# Altium schematic sheet MGD.SCH1.SchDoc
size C
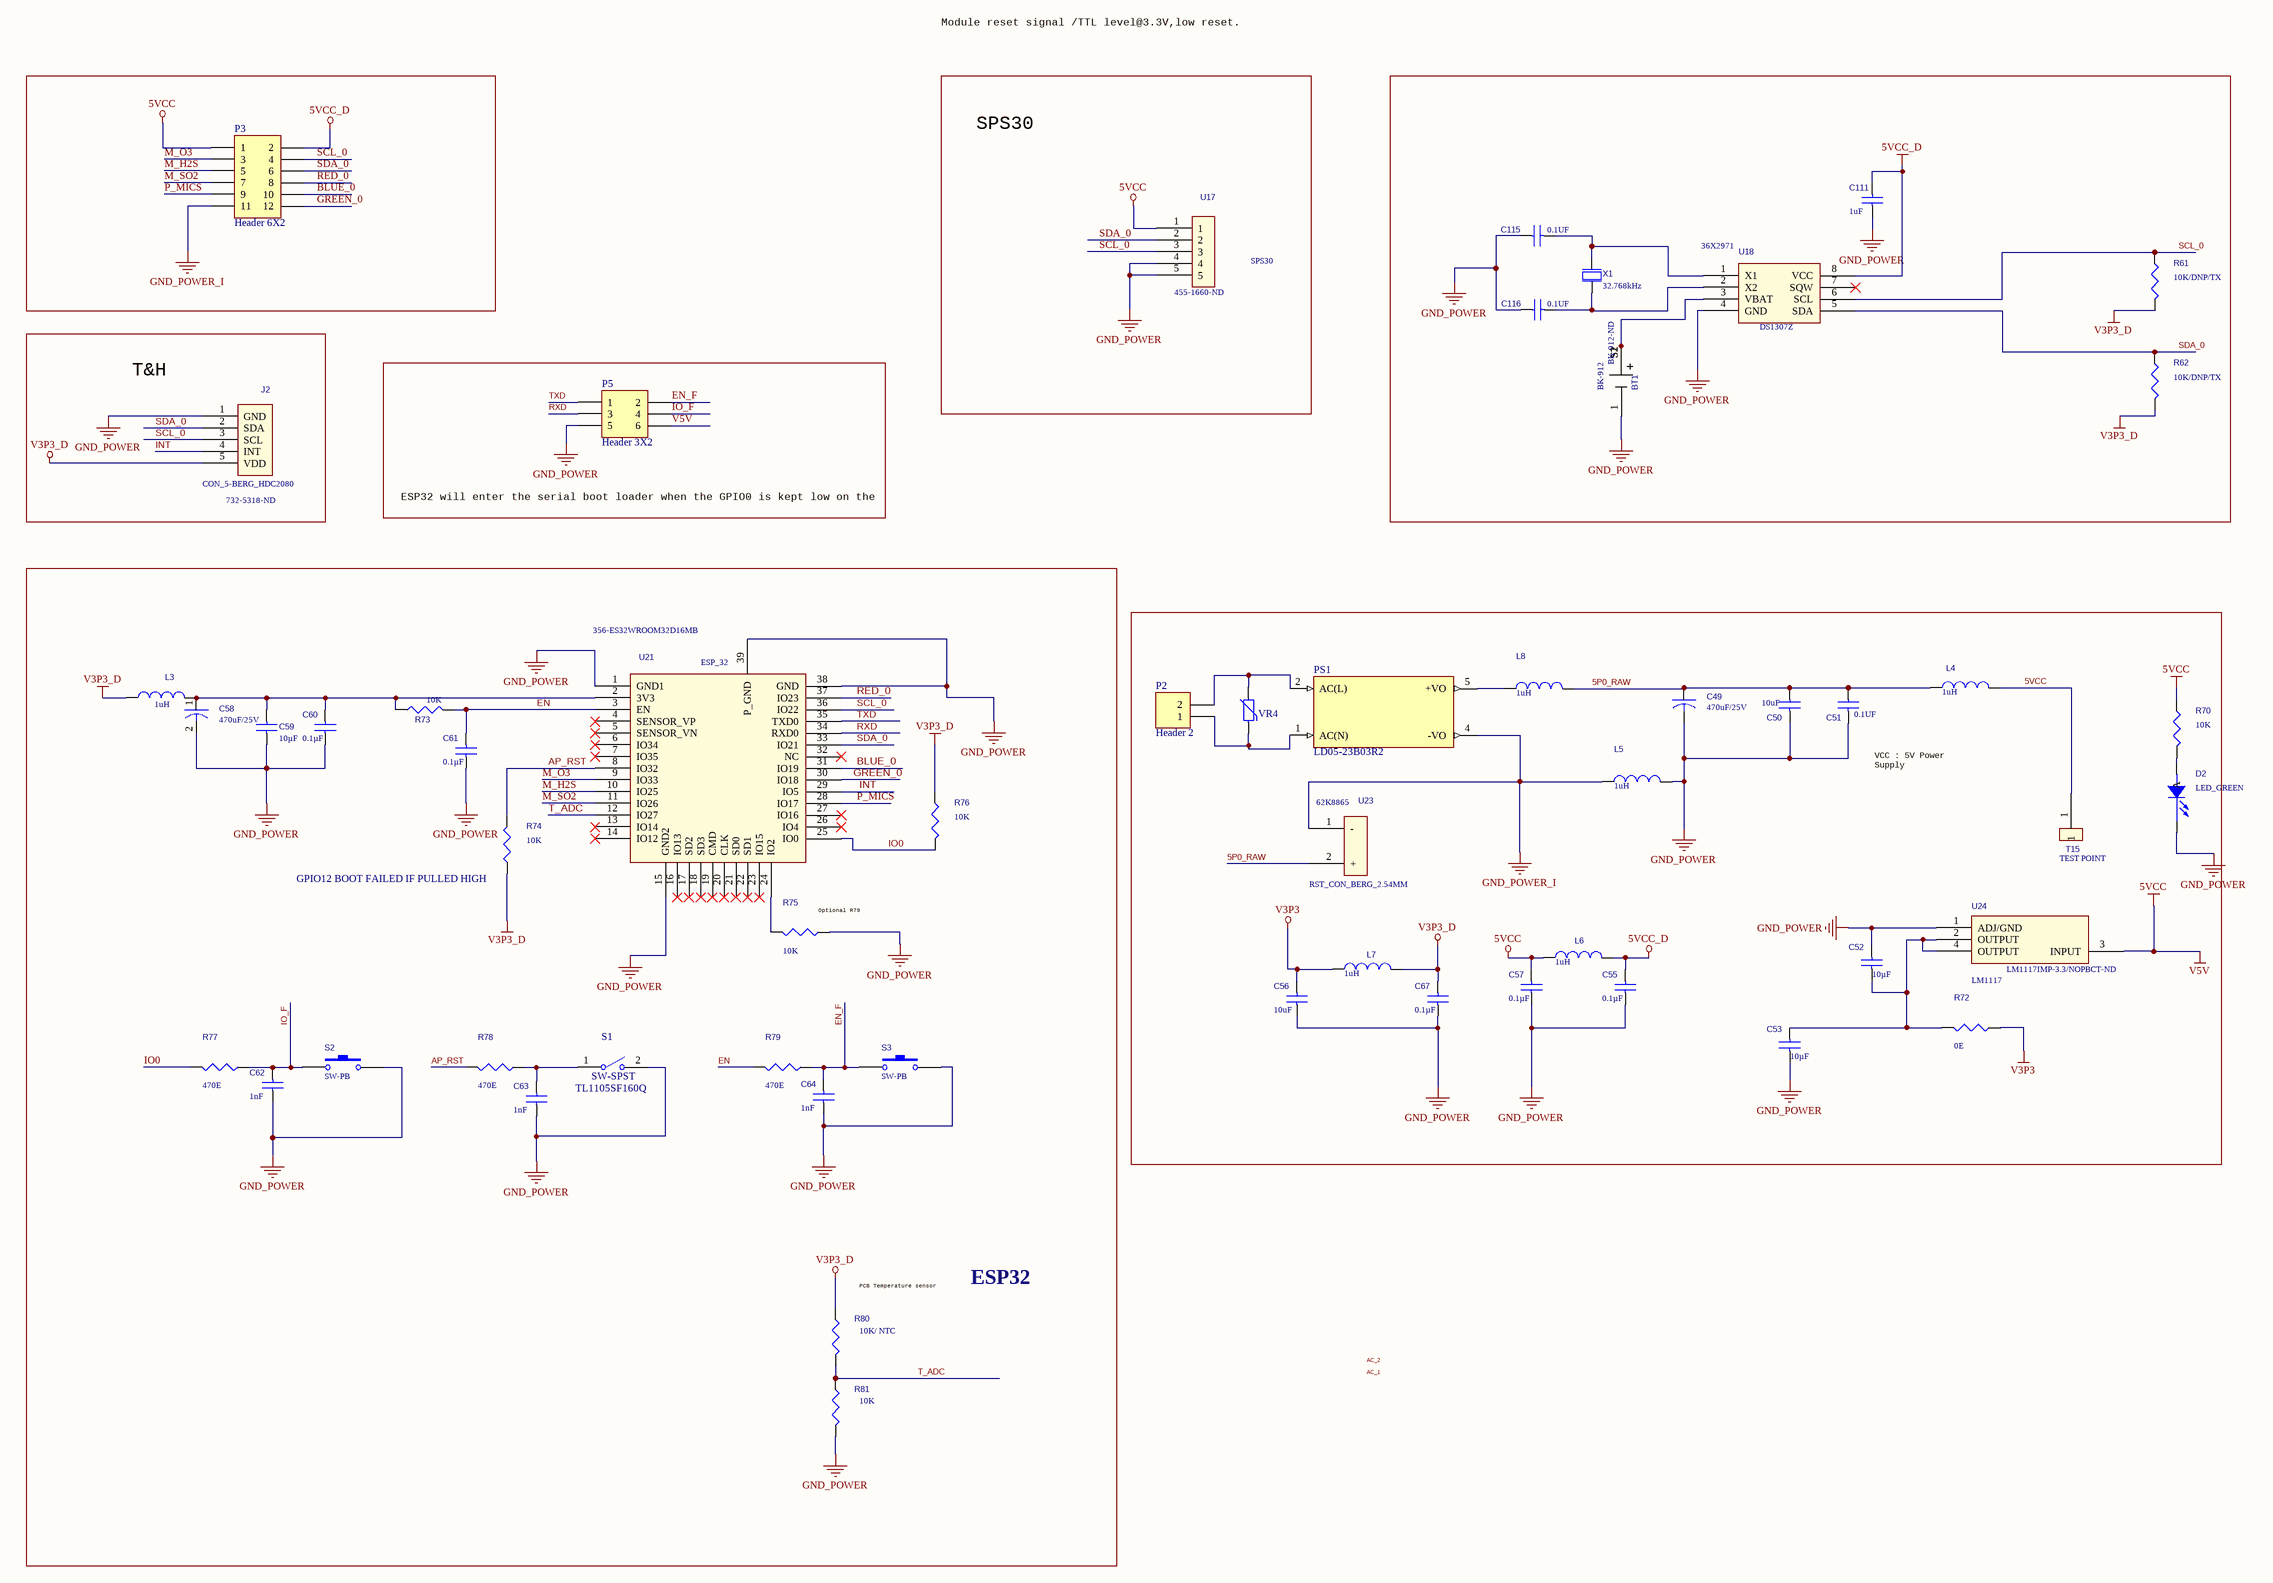
[diagram p0: MGD.SCH1.SchDoc]

## Parts
BT1  BK-912  Supplier Part Number 1: BK-912-ND  [BT1]
C49  470uF/25V  [C16, C49, C58]
C50  10uF  [C0603]
C51  0.1UF  [C0603]
C52  10µF  [C0603]
C53  10µF  [C0603]
C55  0.1µF  [C0603]
C56  10uF  [C0603]
C57  0.1µF  [C0603]
C58  470uF/25V  [C16, C49, C58]
C59  10µF  [C0603]
C60  0.1µF  [C0603]
C61  0.1µF  [C0603]
C62  1nF  [C0603]
C63  1nF  [C0603]
C64  1nF  [C0603]
C67  0.1µF  [C0603]
C111  1uF  [C0603]
C115  0.1UF  [C0603]
C116  0.1UF  [C0603]
D2  LED_GREEN  [D2              L0603]
J2  CON_5-BERG_HDC2080  Supplier Part Number 1: 732-5318-ND  [J2]
L3  1uH  [L3, L4, L5, L6, L7]
L4  1uH  [L3, L4, L5, L6, L7]
L5  1uH  [L3, L4, L5, L6, L7]
L6  1uH  [L3, L4, L5, L6, L7]
L7  1uH  [L3, L4, L5, L6, L7]
L8  1uH  [C0603]
P2  Header 2  [TE 282834-2]
P3  Header 6X2  [P1,P3_Updated]
P5  Header 3X2  [P5 - new]
PS1  LD05-23B03R2  [CONV_LD05-23B03R2]
R61  10K/DNP/TX  [R0603]
R62  10K/DNP/TX  [R0603]
R70  10K  [R0603]
R72  0E  [R0603]
R73  10K  [R0603]
R74  10K  [R0603]
R75  10K  [R0603]
R76  10K  [R0603]
R77  470E  [R0603]
R78  470E  [R0603]
R79  470E  [R0603]
R80  10K/ NTC  [R0603]
R81  10K  [R0603]
S1  SW-SPST  Part Number: TL1105SF160Q  [S1]
S2  SW-PB  [S2, S3]
S3  SW-PB  [S2, S3]
T15  TEST POINT  [TP]
U17  SPS30  Supplier Part Number 1: 455-1660-ND  [U17]
U18  DS1307Z  Supplier Part Number 1: 36X2971  [U18 new]
U21  ESP_32  Supplier Part Number 1: 356-ES32WROOM32D16MB  [U20             ESP 32]
U23  RST_CON_BERG_2.54MM  Supplier Part Number 1: 62K8865  [U23]
U24  LM1117  Supplier Part Number 1: LM1117IMP-3.3/NOPBCT-ND  [U1, U24              SOT-223]
VR4  (no value)  [Mov]
X1  32.768kHz  [XTAL]

## Blocks framed on the sheet
SPS30: U17
T&H: J2
ESP32: C58-C64 L3 R73-R81 S1-S3 U21

## Nets
5VCC: C57.2 L4.2 L6.1 P3.1 P5.6 R70.1 T15.1 U17.1 U24.3(INPUT)  [also labelled V5V]
5VCC_D: C55.2 C111.2 L6.2 P3.2 U18.8(VCC)
GND_POWER: BT1.1(NEG) C49.2 C50.2 C51.2 C52.1 C53.2 C55.1 C56.1 C57.1 C58.2 C59.1 C60.1 C61.1 C62.1 C63.1 C64.1 C67.1 C111.1 C115.1 C116.1 D2.2(CATHODE) J2.1(GND) L5.2 P5.5 R75.1 R81.2 S1.2(NO) S2.2 S3.2 U17.4 U17.5 U18.4(GND) U21.1(GND1) U21.15(GND2) U21.38(GND) U21.39(P_GND) U24.1(ADJ/GND)
GND_POWER_I: L5.1 P3.11 PS1.4(-VO) U23.1(-)
V3P3: C56.2 L7.1 R72.1
V3P3_D: C67.2 J2.5(VDD) L3.1 L7.2 R61.2 R62.2 R74.1 R76.1 R80.1
5P0_RAW: C49.1 C50.1 C51.1 L4.1 L8.2 U23.2(+)
AP_RST: R74.2 R78.2 U21.8(IO32)
BLUE_0: P3.10 U21.31(IO19)
EN: C61.2 R73.2 R79.2 U21.3(EN)
EN_F: C64.2 P5.2 R79.1 S3.1
GREEN_0: P3.12 U21.30(IO18)
INT: J2.4(INT) U21.29(IO5)
IO0: R76.2 R77.2 U21.25(IO0)
IO_F: C62.2 P5.4 R77.1 S2.1
M_H2S: P3.5 U21.10(IO25)
M_O3: P3.3 U21.9(IO33)
M_SO2: P3.7 U21.11(IO26)
P_MICS: P3.9 U21.28(IO17)
RED_0: P3.8 U21.37(IO23)
RXD: P5.3 U21.34(RXD0)
SCL_0: J2.3(SCL) P3.4 R61.1 U17.3 U18.6(SCL) U21.36(IO22)
SDA_0: J2.2(SDA) P3.6 R62.1 U17.2 U18.5(SDA) U21.33(IO21)
T_ADC: R80.2 R81.1 U21.12(IO27)
TXD: P5.1 U21.35(TXD0)
NetBT1_S1: BT1.S1(POS) BT1.S2(POS) U18.3(VBAT)
NetC52_2: C52.2 C53.1 R72.2 U24.2(OUTPUT) U24.4(OUTPUT)
NetC58_1: C58.1 C59.2 C60.2 L3.2 R73.1 U21.2(3V3)
NetC63_2: C63.2 R78.1 S1.1(COMMON)
NetC115_2: C115.2 U18.1(X1) X1.1(inp)
NetC116_2: C116.2 U18.2(X2) X1.2(out)
NetD2_1: D2.1(A) R70.2
NetL8_1: L8.1 PS1.5(+VO)
NetP2_1: P2.1 PS1.1(AC(N)) VR4.1
NetP2_2: P2.2 PS1.2(AC(L)) VR4.2
NetR75_2: R75.2 U21.24(IO2)

Not connected (* = marked no-connect by the designer): U18 7(SQW)*; U21 4(SENSOR_VP)* 5(SENSOR_VN)* 6(IO34)* 7(IO35)* 13(IO14)* 14(IO12)* 16(IO13)* 17(SD2)* 18(SD3)* 19(CMD)* 20(CLK)* 21(SD0)* 22(SD1)* 23(IO15)* 26(IO4)* 27(IO16)* 32(NC)*

## Notes on the sheet
- Module reset signal /TTL level@3.3V,low reset.
- ESP32 will enter the serial boot loader when the GPIO0 is kept low on the reset.
  Otherwise, it will run the program in flash.
- VCC : 5V Power Supply
  D-  : USB D- Signal
  D+ : USB D+ Signal
  ID  : USB Identifier Signal for OTG Devices
  GND : Power Ground
- (near R74) GPIO12 BOOT FAILED IF PULLED HIGH
- (near R75) Optional R79
- (near R80) PCB Temperature sensor
- Labels drawn without touching a wire or pin: AC_1, AC_2

## Library data of the parts
BT1 = BK-912: BATTERY RETAINER COIN 20MM SMD; MF: MPD; Price: None; Package: None; MP: BK-912; Availability: Unavailable; SnapEDA_Link: https://www.snapeda.com/parts/BK-912/Memory%20Protection%20Devices/view-part/4219672/?ref=snap; Value: *; Supplier 1: Digi-Key
C49 C58 = CAP: CAP ALUM 470UF 20% 50V RADIAL; Part Number: 871-B41896E6477M000
C50 C51 C115 C116 = CAP NP: CAP CER 22UF 10V X5R 0603; Part Number: GRM188R61A226ME15D
C52 C53 = CAP_C_10µF/35V: CAP CER SMD 10µF/35V; Manufacturer: Taiyo Yuden; Manufacturer Part Number: GMK316AB7106KL-TR; Tolerance: ±10%; Voltage - Rated: 35V; Temperature Coefficient: X7R; Supplier 1: Digi-Key; Supplier Part Number 1: 587-3007-1-ND; RoHS: RoHS Compliant; Category: Capacitors; Stock 1: 533940; Pricing 1: 1=0.51, 10=0.362, 25=0.3092, 50=0.274, 100=0.2387, 250=0.20328, 500=0.17678, 1000=0.15026 (USD); Packaging: Cut Tape (CT); Part Status: Active; Capacitance: 10µF; Operating Temperature: -55°C ~ 125°C; Features: -; Ratings: -; Applications: General Purpose; Mounting Type: Surface Mount, MLCC; Package / Case: 1206 (3216 Metric); Size / Dimension: 0.126" L x 0.063" W (3.20mm x 1.60mm); Height - Seated (Max): -; Thickness (Max): 0.071" (1.80mm); Lead Spacing: -; Lead Style: -; ComponentLink1URL: http://www.yuden.co.jp/productdata/catalog/en/mlcc06_e.pdf; ComponentLink1Description: http://www.yuden.co.jp/productdata/catalog/en/mlcc06_e.pdf
C55 C57 C61-C64 C67 = CAP_C_0.1µF/16V: CAP CER SMD 0.1µF/16V; Manufacturer: Murata Electronics North America; Manufacturer Part Number: GRM155R61H104KE19D; Tolerance: ±10%; Voltage - Rated: 16V; Temperature Coefficient: X5R; Supplier 1: Digi-Key; Supplier Part Number 1: 490-11917-1-ND; RoHS: RoHS Compliant; Category: Capacitors; Stock 1: 958509; Pricing 1: 1=0.1, 10=0.062, 25=0.0456, 50=0.034, 100=0.0278, 250=0.02328, 500=0.01988, 1000=0.01562, 5000=0.01307 (USD); Packaging: Cut Tape (CT); Part Status: Active; Operating Temperature: -55°C ~ 85°C; Features: -; Ratings: -; Applications: General Purpose; Mounting Type: Surface Mount, MLCC; Package / Case: 0402 (1005 Metric); Size / Dimension: 0.039" L x 0.020" W (1.00mm x 0.50mm); Height - Seated (Max): -; Thickness (Max): 0.022" (0.55mm); Lead Spacing: -; Lead Style: -; ComponentLink1URL: http://www.murata.com/~/media/webrenewal/support/library/catalog/products/capacitor/mlcc/c02e.ashx; ComponentLink1Description: http://www.murata.com/~/media/webrenewal/support/library/catalog/products/capacitor/mlcc/c02e.ashx
  C55 C57 C61 C67: Capacitance: 0.1µF
  C62-C64: Capacitance: 1nF
C56 = CAP_C_0.1µF/16V: CAP CER SMD 0.1µF/16V; Manufacturer: Murata Electronics North America; Manufacturer Part Number: GRM155R61H104KE19D; Capacitance: 0.1µF; Tolerance: ±10%; Voltage - Rated: 16V; Temperature Coefficient: X5R; Supplier 1: Digi-Key; Supplier Part Number 1: 490-11917-1-ND; RoHS: RoHS Compliant; Category: Capacitors; Stock 1: 958509; Pricing 1: 1=0.1, 10=0.062, 25=0.0456, 50=0.034, 100=0.0278, 250=0.02328, 500=0.01988, 1000=0.01562, 5000=0.01307 (USD); Packaging: Cut Tape (CT); Part Status: Active; Operating Temperature: -55°C ~ 85°C; Features: -; Ratings: -; Applications: General Purpose; Mounting Type: Surface Mount, MLCC; Package / Case: 0402 (1005 Metric); Size / Dimension: 0.039" L x 0.020" W (1.00mm x 0.50mm); Height - Seated (Max): -; Thickness (Max): 0.022" (0.55mm); Lead Spacing: -; Lead Style: -; ComponentLink1URL: http://www.murata.com/~/media/webrenewal/support/library/catalog/products/capacitor/mlcc/c02e.ashx; ComponentLink1Description: http://www.murata.com/~/media/webrenewal/support/library/catalog/products/capacitor/mlcc/c02e.ashx
C59 = CAP_C_10µF/10V: CAP CER SMD 10µF/10V; Manufacturer: Yageo; Manufacturer Part Number: CC0805ZKY5V6BB106; Tolerance: -20%, +80%; Voltage - Rated: 10V; Temperature Coefficient: Y5V (F); Supplier 1: Digi-Key; Supplier Part Number 1: 311-1355-1-ND; RoHS: RoHS Compliant; Category: Capacitors; Stock 1: 595702; Pricing 1: 1=0.18, 10=0.131, 25=0.0956, 50=0.0742, 100=0.0615, 250=0.05088, 500=0.04312, 1000=0.03569 (USD); Packaging: Cut Tape (CT); Part Status: Active; Capacitance: 10µF; Operating Temperature: -30°C ~ 85°C; Features: -; Ratings: -; Applications: General Purpose; Failure Rate: -; Mounting Type: Surface Mount, MLCC; Package / Case: 0805 (2012 Metric); Size / Dimension: 0.079" L x 0.049" W (2.00mm x 1.25mm); Height - Seated (Max): -; Thickness (Max): 0.049" (1.25mm); Lead Spacing: -; Lead Style: -; ComponentLink1URL: http://www.yageo.com/documents/recent/UPY-GPHC_Y5V_6.3V-to-50V_8.pdf; ComponentLink1Description: http://www.yageo.com/documents/recent/UPY-GPHC_Y5V_6.3V-to-50V_8.pdf
C60 = CAP_C_0.1µF/16V: CAP CER SMD 0.1µF/16V; Manufacturer: Murata Electronics North America; Manufacturer Part Number: CC0603KRX7R7BB104; Tolerance: ±10%; Voltage - Rated: 16V; Temperature Coefficient: X5R; RoHS: RoHS Compliant; Category: Capacitors; Stock 1: 958509; Pricing 1: 1=0.1, 10=0.062, 25=0.0456, 50=0.034, 100=0.0278, 250=0.02328, 500=0.01988, 1000=0.01562, 5000=0.01307 (USD); Packaging: Cut Tape (CT); Part Status: Active; Capacitance: 0.1µF; Operating Temperature: -55°C ~ 85°C; Features: -; Ratings: -; Applications: General Purpose; Mounting Type: Surface Mount, MLCC; Package / Case: 0603; Size / Dimension: 0.039" L x 0.020" W (1.00mm x 0.50mm); Height - Seated (Max): -; Thickness (Max): 0.022" (0.55mm); Lead Spacing: -; Lead Style: -; ComponentLink1URL: http://www.murata.com/~/media/webrenewal/support/library/catalog/products/capacitor/mlcc/c02e.ashx; ComponentLink1Description: http://www.murata.com/~/media/webrenewal/support/library/catalog/products/capacitor/mlcc/c02e.ashx; Supplier 1: Digi-Key; Supplier Part Number 1: 311-1088-1-ND
C111 = CAP_C_0.1µF/16V: CAP CER SMD 0.1µF/16V; Manufacturer: Murata Electronics North America; Manufacturer Part Number: GRM155R61H104KE19D; Capacitance: 1nF; Tolerance: ±10%; Voltage - Rated: 16V; Temperature Coefficient: X5R; Supplier 1: Digi-Key; Supplier Part Number 1: 490-11917-1-ND; RoHS: RoHS Compliant; Category: Capacitors; Stock 1: 958509; Pricing 1: 1=0.1, 10=0.062, 25=0.0456, 50=0.034, 100=0.0278, 250=0.02328, 500=0.01988, 1000=0.01562, 5000=0.01307 (USD); Packaging: Cut Tape (CT); Part Status: Active; Operating Temperature: -55°C ~ 85°C; Features: -; Ratings: -; Applications: General Purpose; Mounting Type: Surface Mount, MLCC; Size / Dimension: 0.039" L x 0.020" W (1.00mm x 0.50mm); Height - Seated (Max): -; Thickness (Max): 0.022" (0.55mm); Lead Spacing: -; Lead Style: -; ComponentLink1URL: http://www.murata.com/~/media/webrenewal/support/library/catalog/products/capacitor/mlcc/c02e.ashx; ComponentLink1Description: http://www.murata.com/~/media/webrenewal/support/library/catalog/products/capacitor/mlcc/c02e.ashx
D2 = LED: LED GREEN CLEAR THIN 0603 SMD; Manufacturer Part Number: 160-1443-2-ND; Type: Diode; Distributor Part Number: 160-1443-1-ND; Package: 0603; Part Number: 160-1443-2-ND; Supplier 1: Future Electronics; Supplier Part Number 1: LTL-1CHG-BAG
J2 = 5_PIN_CON_0: CONN HEADER VERT 5POS 2.54MM; Part Number: 61300511121; Supplier 1: Digi-Key
L3-L8 = INDUCTOR: FERRITE BEAD 120 OHM 0603 1LN; Part Number: 490-3996-1-ND; Supplier 1: Arrow; Supplier Part Number 1: BLM18SG121TN1D
P2 = Header 2: Header, 2-Pin; LatestRevisionDate: 17-Jul-2002; LatestRevisionNote: Re-released for DXP Platform.; Publisher: Altium Limited
P3 = Header 6X2: Header, 6-Pin, Dual row; LatestRevisionDate: 17-Jul-2002; LatestRevisionNote: Re-released for DXP Platform.; Publisher: Altium Limited
P5 = Header 3X2: Header, 3-Pin, Dual row; LatestRevisionDate: 17-Jul-2002; LatestRevisionNote: Re-released for DXP Platform.; Publisher: Altium Limited
PS1 = LD05-23B03R2: Enclosed AC DC Converters 1 Uitgang 3.3V 1.515A 85 ~ 305 VAC, 100 ~ 430 VDC Input; MF: MORNSUN; Check_prices: https://www.snapeda.com/parts/LD05-23B03R2/MORNSUN/view-part/5823548/?ref=eda; SnapEDA_Link: https://www.snapeda.com/parts/LD05-23B03R2/MORNSUN/view-part/5823548/?ref=snap; Price: None; Package: CUSTOM-4 MORNSUN; Availability: In Stock; Value: *; MP: LD05-23B03R2
R61 R62 R73-R76 R81 = R: RES SMD 4.7K OHM 1% 1/16W 0603; Part Number: 311-10KGRTR-ND; Package: 0603; Type: Resistor
R70 = R: RES SMD 1K OHM 5% 1/10W 0603; Part Number: 311-1.0KGRTR-ND; Package: 0603; Type: Resistor
R72 R77-R79 = R: RES SMD 470 OHM 1% 1/10W 0603; Part Number: 311-470HRCT-ND; Type: Resistor; Package: 0603
R80 = R: THERMISTOR NTC 10KOHM 3380K 0603; Part Number: 490-16279-2-ND; Type: Resistor; Package: 0603
S1 = SW-SPST: SWITCH TACTILE SPST-NO 0.05A 12V; Published: 24-Mar-1999; LatestRevisionDate: 17-Jul-2002; LatestRevisionNote: Re-released for DXP Platform.; PackageReference: SPST-2; Publisher: Altium Limited; PackageDescription: Switch; 2 Leads
S2 S3 = SW-PB: Switch; Published: 24-Mar-1999; LatestRevisionDate: 17-Jul-2002; LatestRevisionNote: Re-released for DXP Platform.; PackageReference: SPST-2; Publisher: Altium Limited; PackageDescription: Switch; 2 Leads
T15 = Test_P
U17 = PROG_ESP32_0: Part Number: 490107670412; Supplier 1: Digi-Key
U18 = MP1584_SOIC_0: IC RTC CLK/CALENDAR I2C 8-SOIC; Supplier 1: Newark
U21 = ESP32_SMD_1: WIFI MODULE 128MBITS SPI FLASH; Part Number: 356-ES32WROOM32D16MB; Supplier 1: Mouser
U23 = CON_AC_1: CONN HEADER VERT 2POS 2.54MM; Part Number: 609-4434-ND; Supplier 1: Newark
U24 = TLV70033DDCT: 3.3V LDO; Manufacturer: Texas Instruments; Regulator Topology: Positive Fixed; Current - Output: 200mA; Voltage - Input: Up to 5.5V; Current - Limit (Min): 220mA; Manufacturer Part Number: LM1117; RoHS: RoHS Compliant; Category: Integrated Circuits (ICs); Stock 1: 5021; Pricing 1: 1=0.53, 10=0.452, 100=0.3374 (USD); Packaging: Cut Tape (CT); Part Status: Active; Voltage - Output: 3.3V; Voltage - Dropout (Typical): -; Operating Temperature: -40°C ~ 125°C; Mounting Type: Surface Mount; Package / Case: SOT-23-5 Thin, TSOT-23-5; Supplier Device Package: SOT-23-5; ComponentLink1URL: http://www.ti.com/lit/ds/slvsa00e/slvsa00e.pdf; ComponentLink1Description: http://www.ti.com/lit/ds/slvsa00e/slvsa00e.pdf; Supplier 1: Digi-Key
VR4 = Metal Oxide Variaster: SMT Resistor; Value: ="Resistance in Ohms @ 25C"
X1 = XTAL_2-pin: XTAL SMD 3215, 32.768kHz, Cl=9pF, Total Tol: ±50ppm; Part Number: XC1911TR-ND; Note: XTAL SMD 32.768kHz; Artikkelnr Noca: N.A.; Manufacturer: *; Manufacturer Part Number: *; Datasheet: *; LatestRevisionDate: 2016-08-19; Pin Count: 2; Publisher: Nordic Semiconductor; Published: 2016-08-19; Value: 32.768kHz; Supplier: *; Supplier part number: *; 2nd source Supplier: *; 2nd source part number: *; Footprint Doc: XTAL_3215; Artikkelnr Simpro: N.A.; Supplier 1: Digi-Key; Supplier Part Number 1: 535-9033-1-ND